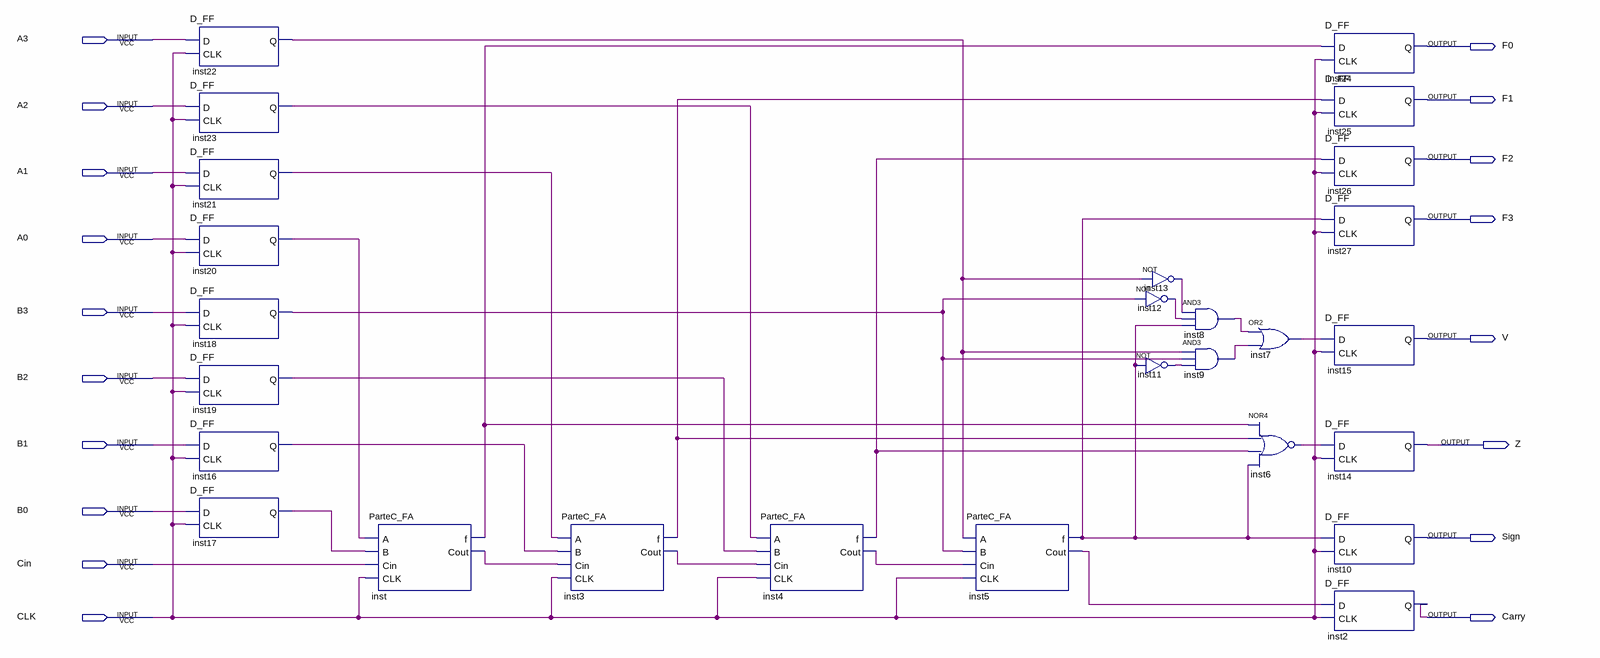
[diagram p0: schematic sheet]
// Quartus schematic Esquematico_C.bdf as structural Verilog: 27 symbols, 18 pins
module Esquematico_C (
  input  A3,
  input  A2,
  input  A1,
  input  A0,
  input  B3,
  input  B2,
  input  B1,
  input  B0,
  input  Cin,
  input  CLK,
  output F0,
  output F1,
  output F2,
  output F3,
  output V,
  output Z,
  output Sign,
  output Carry
);

  wire inst3_cout, inst3_f, inst4_cout, inst4_f, inst5_cout, inst5_f, inst6_out, inst7_out, inst8_out,
       inst9_out, inst11_out, inst12_out, inst13_out, inst16_q, inst17_q, inst18_q, inst19_q, inst20_q,
       inst21_q, inst22_q, inst23_q, inst_cout, inst_f;

  D_FF inst22 (.D(A3), .CLK(CLK), .Q(inst22_q));
  D_FF inst23 (.D(A2), .CLK(CLK), .Q(inst23_q));
  D_FF inst21 (.D(A1), .CLK(CLK), .Q(inst21_q));
  D_FF inst20 (.D(A0), .CLK(CLK), .Q(inst20_q));
  D_FF inst18 (.D(B3), .CLK(CLK), .Q(inst18_q));
  D_FF inst19 (.D(B2), .CLK(CLK), .Q(inst19_q));
  D_FF inst16 (.D(B1), .CLK(CLK), .Q(inst16_q));
  D_FF inst17 (.D(B0), .CLK(CLK), .Q(inst17_q));
  ParteC_FA inst (.A(inst20_q), .B(inst17_q), .Cin(Cin), .CLK(CLK), .f(inst_f), .Cout(inst_cout));
  ParteC_FA inst3 (.A(inst21_q), .B(inst16_q), .Cin(inst_cout), .CLK(CLK), .f(inst3_f), .Cout(inst3_cout));
  ParteC_FA inst4 (.A(inst23_q), .B(inst19_q), .Cin(inst3_cout), .CLK(CLK), .f(inst4_f), .Cout(inst4_cout));
  ParteC_FA inst5 (.A(inst22_q), .B(inst18_q), .Cin(inst4_cout), .CLK(CLK), .f(inst5_f), .Cout(inst5_cout));
  not inst13 (inst13_out, inst22_q);
  not inst12 (inst12_out, inst18_q);
  not inst11 (inst11_out, inst5_f);
  and inst8 (inst8_out, inst13_out, inst12_out, inst5_f);
  and inst9 (inst9_out, inst22_q, inst18_q, inst11_out);
  or inst7 (inst7_out, inst8_out, inst9_out);
  nor inst6 (inst6_out, inst_f, inst3_f, inst4_f, inst5_f);
  D_FF inst24 (.D(inst_f), .CLK(CLK), .Q(F0));
  D_FF inst25 (.D(inst3_f), .CLK(CLK), .Q(F1));
  D_FF inst26 (.D(inst4_f), .CLK(CLK), .Q(F2));
  D_FF inst27 (.D(inst5_f), .CLK(CLK), .Q(F3));
  D_FF inst15 (.D(inst7_out), .CLK(CLK), .Q(V));
  D_FF inst14 (.D(inst6_out), .CLK(CLK), .Q(Z));
  D_FF inst10 (.D(inst5_f), .CLK(CLK), .Q(Sign));
  D_FF inst2 (.D(inst5_cout), .CLK(CLK), .Q(Carry));
endmodule
